# Altium schematic sheet Схема блока USB-UART.SchDoc
size 420 x 297 mm; Address1: Address1; Address2: Address2; Address3: Address3; Address4: Address4; DocumentNumber: АБВГ.123456.001 Э3; SheetNumber: 1; Scale: 1:1; DocumentType: Схема электрическая принципиальная; FirstReferrence: АБВГ.123456.001
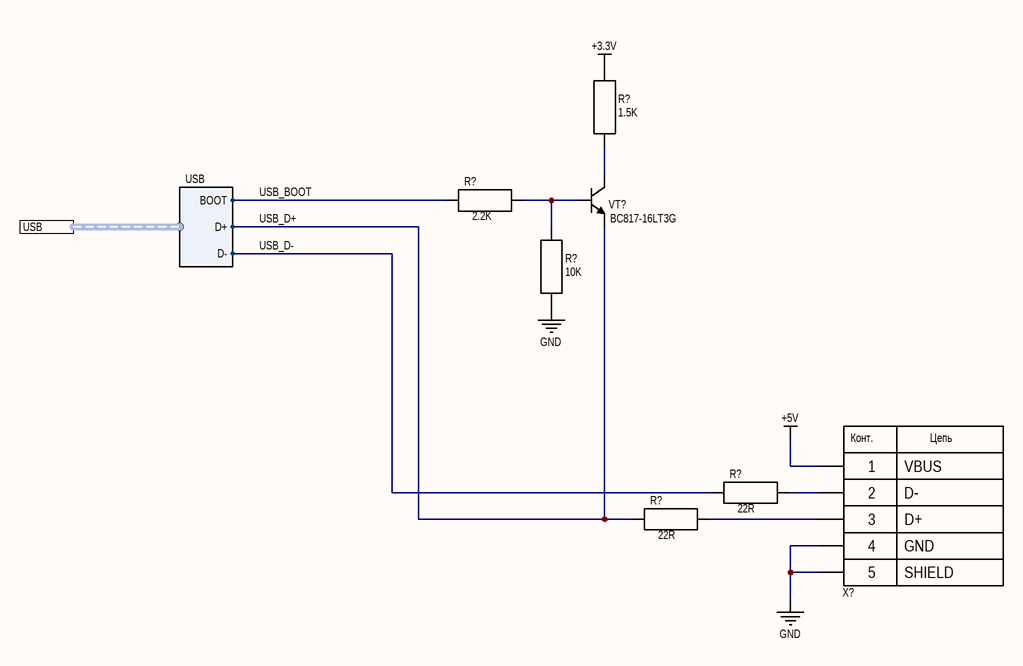
[diagram p0: Схема блока USB-UART.SchDoc]

## Parts
(Parts that share a designator on the sheet are numbered #1, #2 ... from top to bottom, then left to right.)
R?#1  1.5K  [CH0603R]
R?#2  2.2K  [CH0603R]
R?#3  10K  [CH0603R]
R?#4  22R  [CH0603R]
R?#5  22R  [CH0603R]
VT?  BC817-16LT3G  [SOT23_123]
X?  "USB"  [CON: USB-A]  (value not drawn)

## Ports
USB (harness USB)

## Harnesses
USB: BOOT, D+, D-

## Nets
+3.3V: R?#1.2
+5V: X?.1(1________VBUS)
GND: R?#3.1 X?.4(4________GND) X?.5(5________SHIELD)
USB_BOOT: R?#2.1 ; port USB.BOOT
USB_D+: R?#5.1 VT?.3(E) ; port USB.D+
USB_D-: R?#4.1 ; port USB.D-
NetR?#1_1: R?#1.1 VT?.2(C)
NetR?#2_2: R?#2.2 R?#3.2 VT?.1(B)
NetR?#4_2: R?#4.2 X?.2(2________D-)
NetR?#5_2: R?#5.2 X?.3(3________D+)

## Notes on the sheet
- Подп. и дата
- Инв. № дубл.
- Взам. инв. №
- Инв. № подл.
- Изм.
- Лист
- № докум.
- Подп.
- Дата
- 2.106-A3
- Копировал
- Формат А3
- (in symbol USB-A) Конт.; Цепь

## Library data of the parts
R?#1 = Resistor: Manufacturer: Panasonic Electronic Components; Model: ERJ-3EKF1501V; HelpURL: https://www.digikey.com/en/products/detail/panasonic-electronic-components/ERJ-3EKF1501V/196052?s=N4IgTCBcDaIKICUBSBaAzHA0gMQIwFYAGXANRAF0BfIA; ComponentKind: 0603 (1608 Metric); Value: 1.5K
R?#2 = Resistor: Manufacturer: Panasonic Electronic Components; Model: ERJ-3GEYJ222V; HelpURL: https://www.digikey.com/en/products/detail/panasonic-electronic-components/ERJ-3GEYJ222V/135862?s=N4IgTCBcDaIKICUBSBaAzAcTgTSWfAaiALoC%2BQA; ComponentKind: 0603 (1608 Metric); Value: 2.2K
R?#3 = Resistor: Manufacturer: Panasonic Electronic Components; Model: ERJ-3GEYJ103V; HelpURL: https://www.digikey.com/en/products/detail/panasonic-electronic-components/ERJ-3GEYJ103V/135662?s=N4IgTCBcDaIKICUBSBaAzAcTgTSQRgAY0A1EAXQF8g; ComponentKind: 0603 (1608 Metric); Value: 10K
R?#4 R?#5 = Resistor: Manufacturer: Panasonic Electronic Components; Model: ERJ-3GEYJ220V; HelpURL: https://www.digikey.com/en/products/detail/panasonic-electronic-components/ERJ-3GEYJ220V/135600?s=N4IgTCBcDaIKICUBSBaAzAcTgTSWMADAGogC6AvkA; ComponentKind: 0603 (1608 Metric); Value: 22R
VT? = Transistor NPN: Bipolar; Manufacturer: onsemi; Model: BC817-16LT3G; ComponentKind: SOT-23-3 (TO-236); HelpURL: https://www.digikey.com/en/products/detail/onsemi/bc817-16lt3g/1475941
X? = USB-A: USB; Manufacturer: TE Connectivity; Model: 292303-2; HelpURL: https://www.digikey.com/product-detail/en/te-connectivity-amp-connectors/292303-2/A105221-ND/953990; ComponentKind: type A